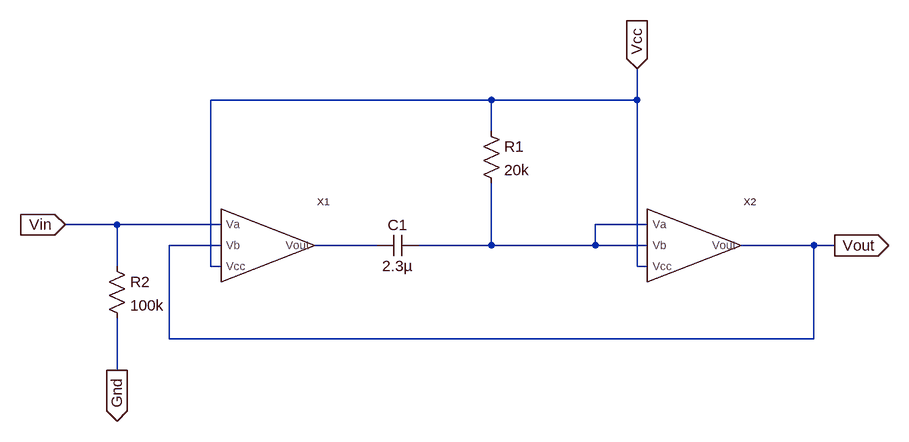
[diagram p0: schematic MNStable_MLTIVibrator.asc]
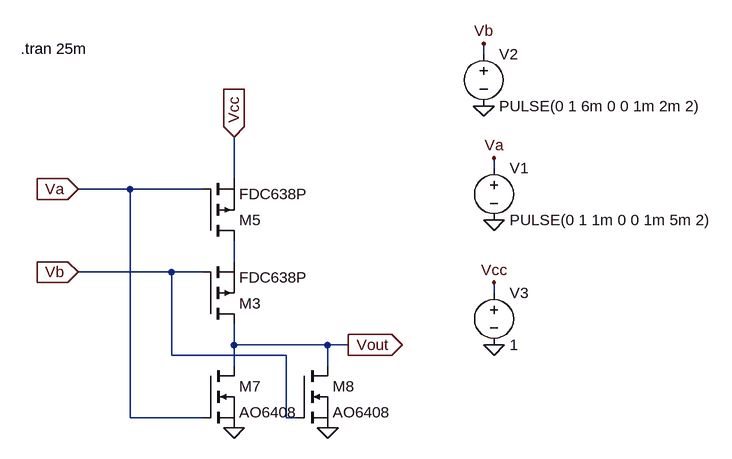
[diagram p1: sub-circuit nor.asc]
MNStable_MLTIVibrator.asc, the LTspice schematic file:
Version 4
SHEET 1 1732 924
WIRE 800 144 368 144
WIRE 1024 144 1024 96
WIRE 1024 144 800 144
WIRE 800 192 800 144
WIRE 224 336 144 336
WIRE 384 336 224 336
WIRE 1040 336 960 336
WIRE 384 368 304 368
WIRE 624 368 528 368
WIRE 800 368 800 272
WIRE 800 368 688 368
WIRE 960 368 960 336
WIRE 960 368 800 368
WIRE 1040 368 960 368
WIRE 1296 368 1184 368
WIRE 1328 368 1296 368
WIRE 224 400 224 336
WIRE 368 400 368 144
WIRE 384 400 368 400
WIRE 1024 400 1024 144
WIRE 1040 400 1024 400
WIRE 304 512 304 368
WIRE 1296 512 1296 368
WIRE 1296 512 304 512
WIRE 224 560 224 480
FLAG 1024 96 Vcc
IOPIN 1024 96 In
FLAG 144 336 Vin
IOPIN 144 336 In
FLAG 1328 368 Vout
IOPIN 1328 368 Out
FLAG 224 560 Gnd
IOPIN 224 560 Out
SYMBOL res 784 176 R0
SYMATTR InstName R1
SYMATTR Value 20k
SYMBOL NOR 448 368 R0
SYMATTR InstName X1
SYMBOL NOR 1104 368 R0
SYMATTR InstName X2
SYMBOL cap 688 352 R90
WINDOW 0 0 32 VBottom 2
WINDOW 3 32 32 VTop 2
SYMATTR InstName C1
SYMATTR Value 2.3µ
SYMBOL res 208 384 R0
SYMATTR InstName R2
SYMATTR Value 100k

nor.asc, the sub-circuit schematic file:
Version 4
SHEET 1 1332 800
WIRE 752 16 752 0
WIRE 768 192 768 176
WIRE 368 208 368 144
WIRE 208 224 128 224
WIRE 320 224 208 224
WIRE 368 336 368 304
WIRE 272 352 128 352
WIRE 320 352 272 352
WIRE 768 384 768 368
WIRE 368 464 368 432
WIRE 512 464 368 464
WIRE 544 464 512 464
WIRE 272 480 272 352
WIRE 448 480 272 480
WIRE 368 496 368 464
WIRE 512 496 512 464
WIRE 208 576 208 224
WIRE 320 576 208 576
WIRE 448 576 448 480
WIRE 464 576 448 576
FLAG 368 144 Vcc
IOPIN 368 144 In
FLAG 544 464 Vout
IOPIN 544 464 Out
FLAG 128 224 Va
IOPIN 128 224 In
FLAG 128 352 Vb
IOPIN 128 352 In
FLAG 368 592 0
FLAG 512 592 0
FLAG 752 96 0
FLAG 768 272 0
FLAG 752 0 Vb
FLAG 768 176 Va
FLAG 768 464 0
FLAG 768 368 Vcc
SYMBOL pmos 320 304 M180
SYMATTR InstName M5
SYMATTR Value FDC638P
SYMBOL nmos 320 496 R0
SYMATTR InstName M7
SYMATTR Value AO6408
SYMBOL nmos 464 496 R0
SYMATTR InstName M8
SYMATTR Value AO6408
SYMBOL pmos 320 432 M180
SYMATTR InstName M3
SYMATTR Value FDC638P
SYMBOL voltage 768 176 R0
SYMATTR InstName V1
SYMATTR Value PULSE(0 1 1m 0 0 1m 5m 2)
SYMBOL voltage 752 0 R0
SYMATTR InstName V2
SYMATTR Value PULSE(0 1 6m 0 0 1m 2m 2)
SYMBOL voltage 768 368 R0
SYMATTR InstName V3
SYMATTR Value 1
TEXT 40 8 Left 2 !.tran 25m

The netlist it stands for:
* MNStable_MLTIVibrator.asc
R1 Vcc N001 20k
XX1 Vin Vout Vcc N002 nor
XX2 N001 N001 Vcc Vout nor
C1 N001 N002 2.3µ
R2 Vin Gnd 100k

* block symbol definitions
.subckt nor Va Vb Vcc Vout
M5 N001 Va Vcc Vcc FDC638P
M7 Vout Va 0 0 AO6408
M8 Vout Vb 0 0 AO6408
M3 Vout Vb N001 N001 FDC638P
V1 Va 0 PULSE(0 1 1m 0 0 1m 5m 2)
V2 Vb 0 PULSE(0 1 6m 0 0 1m 2m 2)
V3 Vcc 0 1
.tran 25m
.ends nor

.model NMOS NMOS
.model PMOS PMOS
.lib standard.mos
.backanno
.end